# Altium schematic sheet RF_FILTER.SchDoc
size A4; DocumentNumber: 5; SheetNumber: 6; SheetTotal: 11
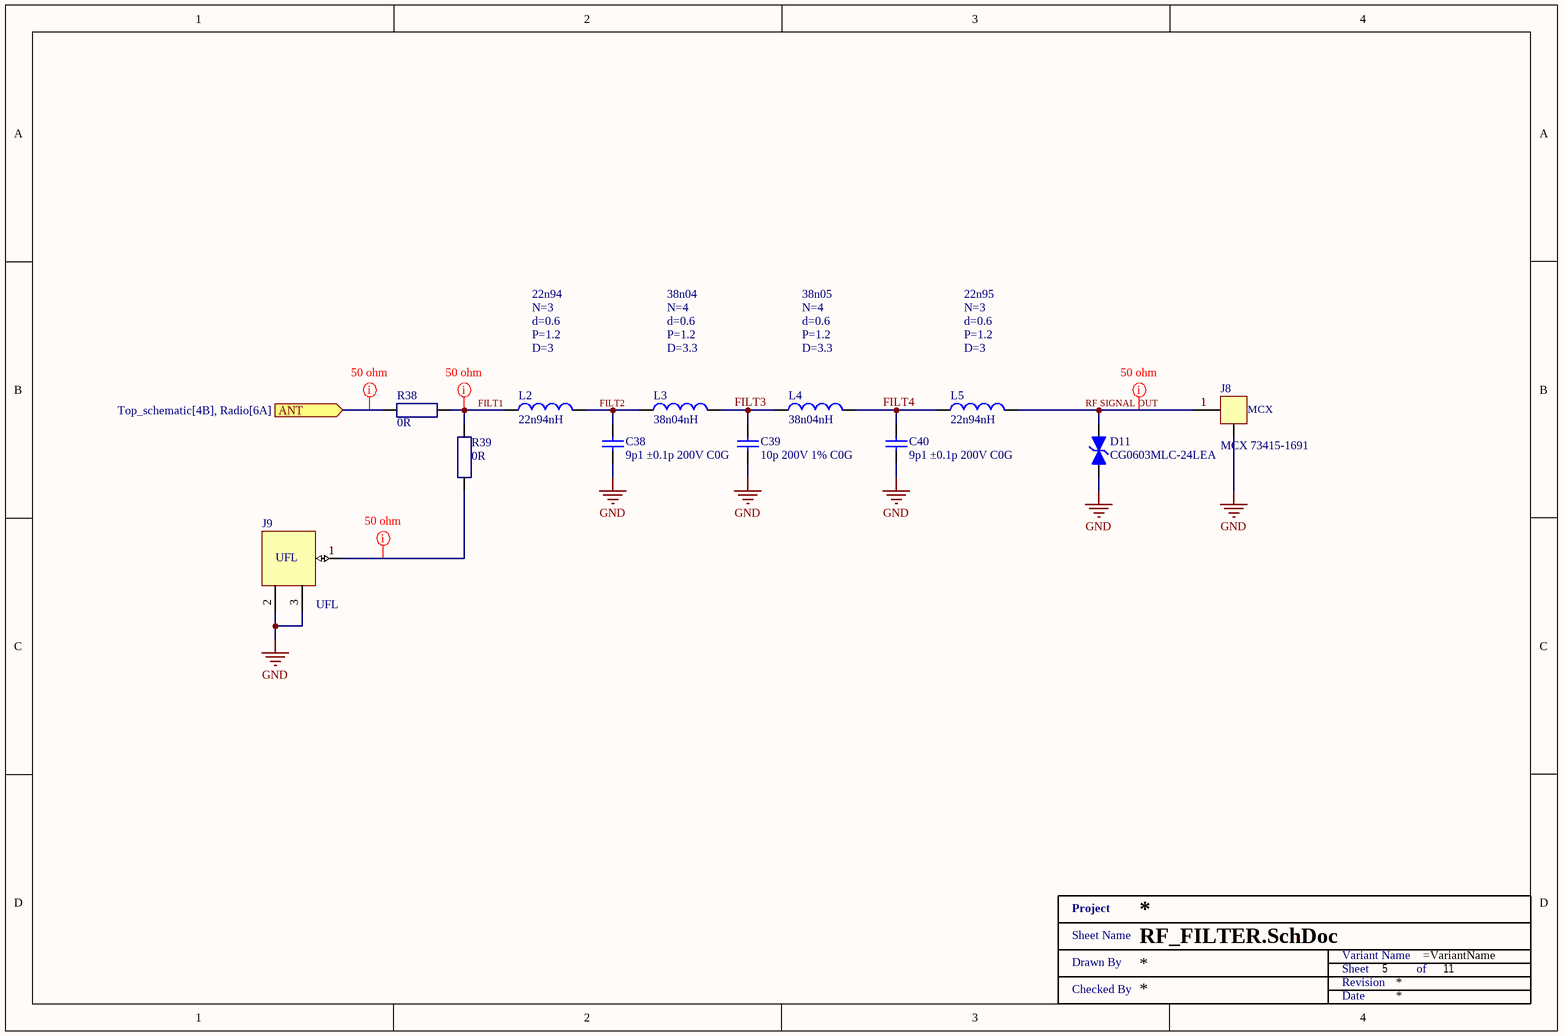
[diagram p0: RF_FILTER.SchDoc]

## Parts
C38  9p1 ±0.1p 200V C0G  [SMD0603]
C39  10p 200V 1% C0G  [SMD0603]
C40  9p1 ±0.1p 200V C0G  [SMD0603]
D11  CG0603MLC-24LEA  [SMD0603 - R]
J8  MCX 73415-1691  [MCX_SMD_vertical]
J9  UFL  [CONUFL001-SMD-T]
L2  22n94nH  [Air-Inductor-25nH]
L3  38n04nH  [Air-Inductor-40nH]
L4  38n04nH  [Air-Inductor-40nH]
L5  22n94nH  [Air-Inductor-25nH]
R38  0R  [SMD0603 - R]
R39  0R  [SMD0603 - R]
XX?  Title 1  (value not drawn)  (graphical)

## Ports
ANT (in, see Top_schematic[4B], Radio[6A])

## Nets
GND: C38.1 C39.1 C40.1 D11.1(A) J8.2(GND) J9.2(GND) J9.3(GND)
ANT: R38.1 ; port ANT
FILT1: L2.1 R38.2 R39.2
FILT2: C38.2 L2.2 L3.1
FILT3: C39.2 L3.2 L4.1
FILT4: C40.2 L4.2 L5.1
RF SIGNAL OUT: D11.2(K) J8.1(INPUT) L5.2
NetJ9_1: J9.1(S) R39.1

## Layout directives
net class 50 ohm: ANT, FILT1, NetJ9_1, RF SIGNAL OUT

## Notes on the sheet
- 22n94
- N=3
- 38n04
- N=4
- 38n05
- 22n95
- d=0.6
- P=1.2
- D=3
- D=3.3
- (in symbol Title 1) Project; Sheet Name; Variant Name; Drawn By; Sheet; of; Revision; Checked By; Date

## Library data of the parts
C38 C40 = 06032U9R1BAT2A: Cap SMD U" Series Low ESR 0603 200V C0G (NP0) 9.1pF ±0.1pF for Comm/RF/µWave Apps Ni/Sn Plated 7"T/R"; Manufacturer: Kyocera AVX; Supplier 1: Mouser; Supplier Part Number 1: 581-06032U9R1BAT2A; Manufacturer Part Number: 06032U9R1BAT2A; RoHS: Yes; Category: Ceramic Capacitors; Stock 1: 4736; Pricing 1: 1=0.3, 10=0.201, 50=0.201, 100=0.114, 1000=0.074, 10000=0.058 (USD); ComponentLink1URL: https://datasheet.ciiva.com/207/useries-207450.pdf?src-supplier=Digikey; ComponentLink1Description: https://datasheet.ciiva.com/207/useries-207450.pdf?src-supplier=Digikey; Capacitance: 9p1
C39 = 06032U100FAT2A: Cap Ceramic 10pF 200V C0G 1% Pad SMD 0603 125°C Ultra Low ESR T/R; Manufacturer: Kyocera AVX; Supplier 1: Mouser; Supplier Part Number 1: 581-06032U100FAT2A; Manufacturer Part Number: 06032U100FAT2A; RoHS: Yes; Category: Ceramic Capacitors; Stock 1: 12241; Pricing 1: 1=0.33, 10=0.227, 50=0.227, 100=0.137, 1000=0.087, 10000=0.07 (USD); ComponentLink1URL: https://datasheet.ciiva.com/219/useries-219573.pdf?src-supplier=Digi-Key; ComponentLink1Description: https://datasheet.ciiva.com/219/useries-219573.pdf?src-supplier=Digi-Key; ComponentLink2URL: https://datasheet.ciiva.com/16209/useries-16209209.pdf?src-supplier=Future+Electronics; ComponentLink2Description: https://datasheet.ciiva.com/16209/useries-16209209.pdf?src-supplier=Future+Electronics; Supplier 2: Arrow Electronics; Supplier Part Number 2: 06032U100FAT2A; Supplier 3: Newark; Supplier Part Number 3: 96Y8278; Capacitance: 10p
D11 = CG0603MLC-24LEA: ESD Suppressor ±25KV 2-Pin Case 0603 T/R; Manufacturer: Bourns; Number of Circuits: 1; Max Voltage Rating (DC): 24V; Clamping Voltage: 25V; Leakage Current: 5nA; Capacitance: 0.5pF; Element Configuration: Single; Supplier 1: Mouser; Supplier Part Number 1: 652-CG0603MLC-24LEA; Manufacturer Part Number: CG0603MLC-24LEA; RoHS: Yes; Category: Varistors; Stock 1: 8361; Pricing 1: 1=0,29000, 10=0,24400, 50=0,24400, 100=0,22700, 1000=0,16000, 10000=0,10800 (USD); Mount: Surface Mount; Case/Package: 0603; Number of Pins: 2; Contact Plating: Tin; Min Operating Temperature: -40°C; Max Operating Temperature: 85°C; Working Voltage: 24V; Packaging: Tape and Reel; Package Quantity: 5000; Length: 1.6mm; Depth: 0.8mm; Radiation Hardening: No; ComponentLink1URL: https://datasheet.ciiva.com/29507/mlc-29507976.pdf?src-supplier=Digi-Key; ComponentLink1Description: https://datasheet.ciiva.com/29507/mlc-29507976.pdf?src-supplier=Digi-Key; Supplier 2: Digi-Key; Supplier Part Number 2: CG0603MLC-24LEA-ND; Supplier 3: Arrow Electronics; Supplier Part Number 3: CG0603MLC-24LEA
J8 = 73415-1691: MOLEX - 73415-1691 - RF COAXIAL, MCX, STRAIGHT JACK, 50OHM; Connector Type: MCX Coaxial; Coaxial Termination: Surface Mount Vertical; Impedance: 50; Frequency Max: 6; Connector Mounting: PCB Mount; Contact Termination: Solder; Body Material: Brass; Body Finish: Gold; Dielectric Material: Polytetrafluoroethylene (PTFE); Center Contact Material: Beryllium Copper; Mating Cycles: 500; Manufacturer: MOLEX; Manufacturer Part Number: 73415-1691; RoHS: YES; Stock 1: 733; Pricing 1: 1=1.65, 10=1.4, 50=1.25, 100=1.13, 250=1.06, 500=0.995 (GBP); Connector Body Style: Straight Jack; Coaxial Cable Types: -; Contact Material: Beryllium Copper; Contact Plating: Gold Plated Contacts; Product Range: -; Termination Method: Surface Mount<!--FANDB--><div class="features-and-benefits-container"><div class="features-and-benefits-description"><span class="features-benefits-value">The 73415-1691 is a vertical surface-mount MCX Straight Jack Receptacle made of gold-plated brass body with gold-plated beryllium copper centre contact and a Teflon insulator.</span></div><div class="features-and-benefits-applications"><ul class="features-and-benefits-value"><li class="features-and-benefits-list-item">RF Communications</li><li class="features-and-benefits-list-item">Industrial</li></ul></div></div>; ComponentLink1URL: http://www.farnell.com/cad/1518410.pdf; ComponentLink1Description: http://www.farnell.com/cad/1518410.pdf; ComponentLink2URL: http://www.farnell.com/datasheets/2133682.pdf; ComponentLink2Description: http://www.farnell.com/datasheets/2133682.pdf; Category: Connectors, Interconnects; Stock 4: 39394; Pricing 4: 1=1.95, 10=1.765, 25=1.6572, 50=1.5854, 100=1.5133, 250=1.36916, 500=1.26106, 1000=1.0809, 2500=1.00884 (USD); Packaging: Tray; Part Status: Active; Connector Style: MCX; Shield Termination: Solder; Mounting Type: Through Hole; Mounting Feature: -; Cable Group: -; Fastening Type: Snap-On; Features: -; Housing Color: Gold; Ingress Protection: -; Includes: -; Center Contact Plating: Gold; Operating Temperature: -55°C ~ 155°C; Insertion Loss: -; ComponentLink3URL: https://www.molex.com/pdm_docs/sd/733660061_sd.pdf; ComponentLink3Description: https://www.molex.com/pdm_docs/sd/733660061_sd.pdf; Supplier 1: Mouser; Supplier Part Number 1: 538-73415-1691; Supplier 2: Farnell; Supplier Part Number 2: 1909246; Supplier 3: Digi-Key; Supplier Part Number 3: WM5559-ND; Supplier 4: Digi-Key; Supplier Part Number 4: WM5541-ND
J9 = CONUFL001-SMD-T: CONN UMC JACK STR SMD; Manufacturer: Linx Technologies Inc.; Connector Style: Ultra Miniature Coaxial; Connector Type: Jack, Male Pin; Supplier 1: Digi-Key; Supplier Part Number 1: CONUFL001-SMD-TCT-ND; Manufacturer Part Number: CONUFL001-SMD-T; RoHS: RoHS Compliant; Category: Connectors, Interconnects; Stock 1: 6423; Pricing 1: 1=0.97, 25=0.882, 100=0.826, 1000=0.742, 2500=0.63 (USD); Packaging: Cut Tape (CT); Part Status: Active; Contact Termination: -; Shield Termination: -; Impedance: -; Mounting Type: Surface Mount; Mounting Feature: -; Cable Group: -; Fastening Type: Snap-On; Features: -; Housing Color: -; Ingress Protection: -; Includes: -; Body Material: -; Body Finish: -; Center Contact Plating: -; Dielectric Material: -; Operating Temperature: -; Center Contact Material: -; Mating Cycles: -; Insertion Loss: -; ComponentLink1URL: http://media.digikey.com/pdf/Data%20Sheets/Linx%20Technologies%20PDFs/CONUFL001-SMD_T_Dwg_RevB_5-15-17.pdf; ComponentLink1Description: http://media.digikey.com/pdf/Data%20Sheets/Linx%20Technologies%20PDFs/CONUFL001-SMD_T_Dwg_RevB_5-15-17.pdf; Supplier 2: Mouser; Supplier Part Number 2: 712-CONUFL001-SMD-T
L2 L5 = Air-Inductor_20nH
L3 L4 = Air-Inductor_40nH
R38 R39 = CRCW06030000Z0EA: RES SMD 0 OHM JUMPER 1/10W 0603; Manufacturer: Vishay Dale; Power (Watts): 0.1W, 1/10W; Manufacturer Part Number: CRCW06030000Z0EA; RoHS: RoHS Compliant; Category: Resistors; Stock 1: 0; Pricing 1: 1=0.1, 10=0.028, 25=0.0204, 50=0.0154, 100=0.0114, 250=0.00868, 500=0.00694, 1000=0.00511 (USD); Packaging: Cut Tape (CT); Part Status: Active; Tolerance: Jumper; Composition: Thick Film; Features: Automotive AEC-Q200; Temperature Coefficient: -; Operating Temperature: -55°C ~ 155°C; Package / Case: 0603 (1608 Metric); Supplier Device Package: 0603; Size / Dimension: 0.063" L x 0.033" W (1.60mm x 0.85mm); Height - Seated (Max): 0.020" (0.50mm); Failure Rate: -; ComponentLink1URL: http://www.vishay.com/docs/20035/dcrcwe3.pdf; ComponentLink1Description: http://www.vishay.com/docs/20035/dcrcwe3.pdf; Resistance: 0R; Supplier 1: Mouser; Supplier Part Number 1: 71-CRCW0603-0-E3; Supplier 2: Farnell; Supplier Part Number 2: 1469739; Supplier 3: Digi-Key; Supplier Part Number 3: 541-0.0GCT-ND